# EasyEDA schematic 1-Schematic_客制化980.json

## Sheets
1 布局: TITLE: Sheet_1; REV: 1.0; Date: 2020-04-07; Sheet: 1/1; Drawn By: ye992; Company: Your Company
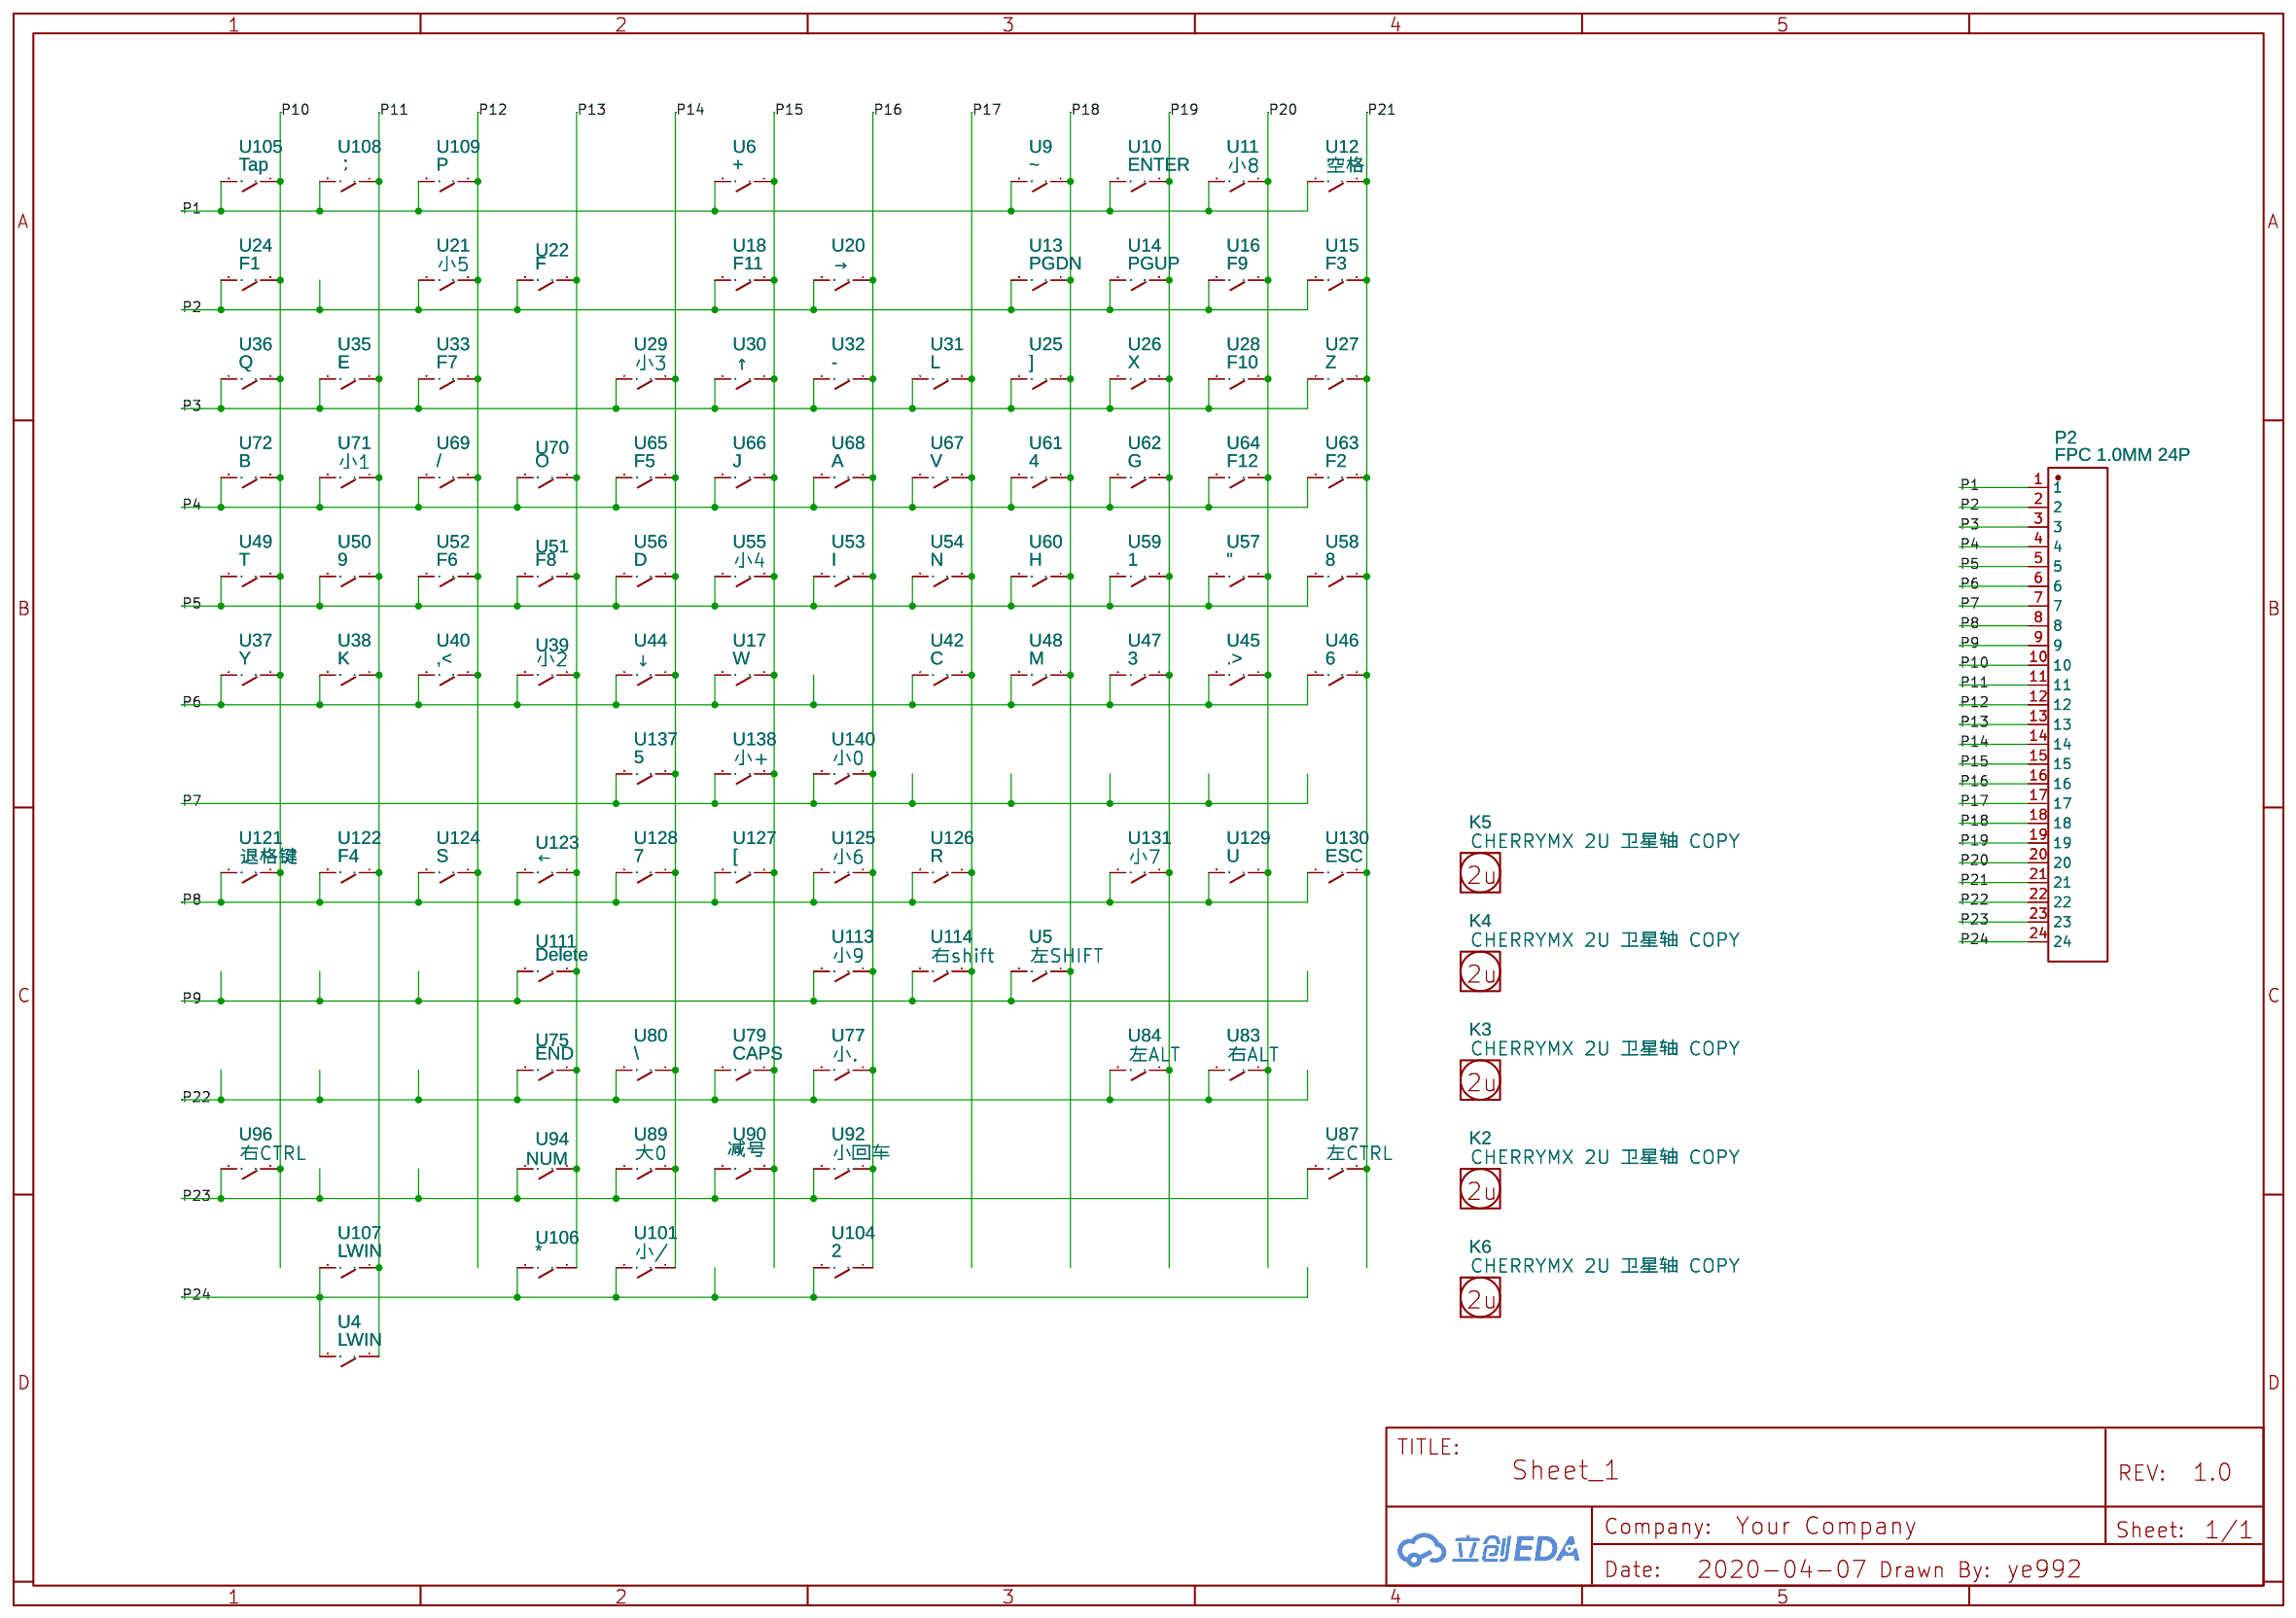
[diagram p0: 布局]
2 Sheet_1: Date: 2020-04-06
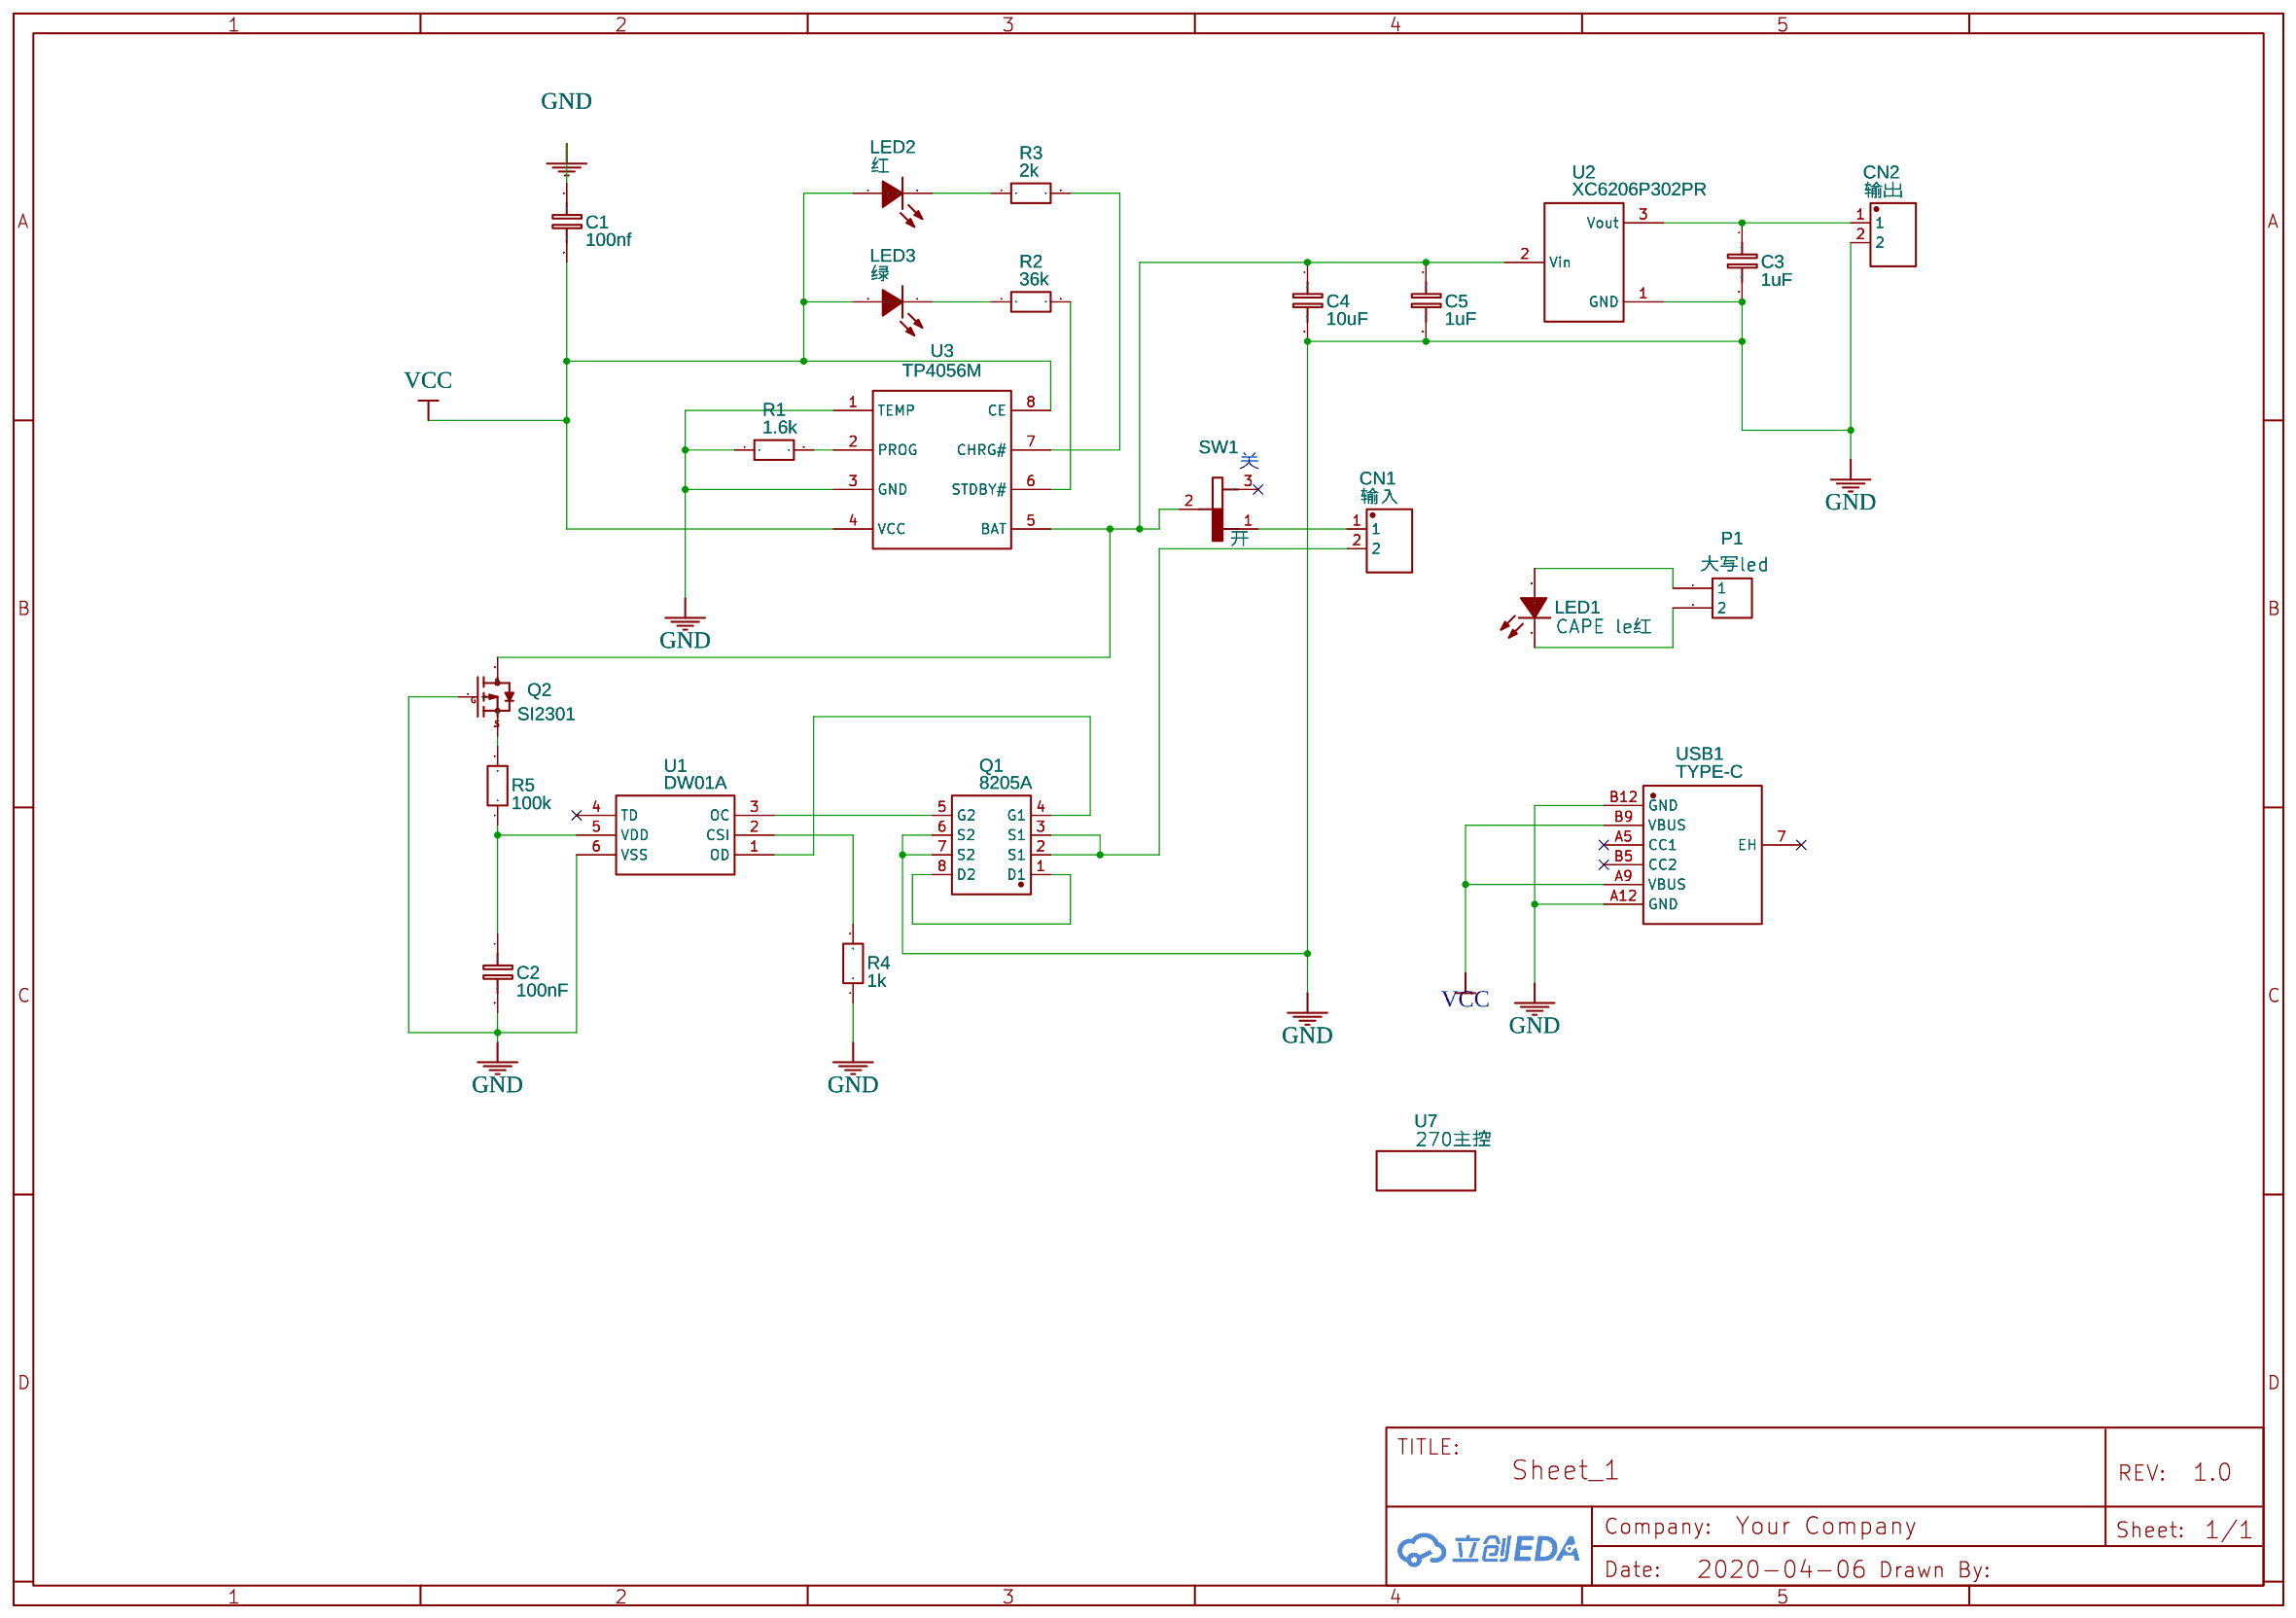
[diagram p1: Sheet_1]

## Parts
sheet Sheet_1
C1  100nf  [1206]
C2  100nF  [1206]
C3  1uF  [1206]
C4  10uF  [1206]
C5  1uF  [1206]
CN1  输入  [DIP-1X2P-2.54MM(5.08X5.08)]
CN2  输出  [DIP-1X2P-2.54MM(5.08X5.08)]
LED1  CAPE le红  [LED1206-R-RD]
LED2  红  [LED1206-R-RD]
LED3  绿  [LED1206-RD]
P1  大写led  [HDR-TH_2P-P2.54-V-M]
Q1  8205A  [TSSOP-8_L4.4-W3.0-P0.65-LS6.4-BL]
Q2  SI2301  [SOT-23-3_L2.9-W1.3-P1.90-LS2.4-BR]
R1  1.6k  [1206]
R2  36k  [1206]
R3  2k  [1206]
R4  1k  [1206]
R5  100k  [1206]
SW1  开  [滑动开关]
U1  DW01A  [SOT-23-6_L2.9-W1.6-P0.95-LS2.8-BL]
U2  XC6206P302PR  [SOT-89_L4.5-W2.5-P1.50-LS4.2-BR]
U3  TP4056M  [MSOP-8_L3.0-W3.0-P0.65-LS5.0-BL-EP]
U7  270主控  [270主控]
USB1  TYPE-C  [TYPE-C-SMD_TYPE-C-6P]
sheet 布局
K2  CHERRYMX 2U 卫星轴 COPY  [CHERRY_MX_2U_卫星轴]
K3  CHERRYMX 2U 卫星轴 COPY  [CHERRY_MX_2U_卫星轴]
K4  CHERRYMX 2U 卫星轴 COPY  [CHERRY_MX_2U_卫星轴]
K5  CHERRYMX 2U 卫星轴 COPY  [CHERRY_MX_2U_卫星轴]
K6  CHERRYMX 2U 卫星轴 COPY  [CHERRY_MX_2U_卫星轴]
P2  FPC 1.0MM 24P  [FPC 1.0MM 24P NO CONNECTOR]
U4  LWIN  [MICAH凯华KAILH热插拔底座]
U5  左SHIFT  [KAILH 2.25U-双用]
U6  +  [MICAH凯华KAILH热插拔底座]
U9  -  [MICAH凯华KAILH热插拔底座]
U10  ENTER  [KAILH 2.25U-双用]
U11  小8  [MICAH凯华KAILH热插拔底座]
U12  空格  [KAILH 6.25U 双用]
U13  PGDN  [MICAH凯华KAILH热插拔底座]
U14  PGUP  [MICAH凯华KAILH热插拔底座]
U15  F3  [MICAH凯华KAILH热插拔底座]
U16  F9  [MICAH凯华KAILH热插拔底座]
U17  W  [MICAH凯华KAILH热插拔底座]
U18  F11  [MICAH凯华KAILH热插拔底座]
U20  →  [MICAH凯华KAILH热插拔底座]
U21  小5  [MICAH凯华KAILH热插拔底座]
U22  F  [MICAH凯华KAILH热插拔底座]
U24  F1  [MICAH凯华KAILH热插拔底座]
U25  ]  [MICAH凯华KAILH热插拔底座]
U26  X  [MICAH凯华KAILH热插拔底座]
U27  Z  [MICAH凯华KAILH热插拔底座]
U28  F10  [MICAH凯华KAILH热插拔底座]
U29  小3  [MICAH凯华KAILH热插拔底座]
U30  ↑  [MICAH凯华KAILH热插拔底座]
U31  L  [MICAH凯华KAILH热插拔底座]
U32  -  [MICAH凯华KAILH热插拔底座]
U33  F7  [MICAH凯华KAILH热插拔底座]
U35  E  [MICAH凯华KAILH热插拔底座]
U36  Q  [MICAH凯华KAILH热插拔底座]
U37  Y  [MICAH凯华KAILH热插拔底座]
U38  K  [MICAH凯华KAILH热插拔底座]
U39  小2  [MICAH凯华KAILH热插拔底座]
U40  ,<  [MICAH凯华KAILH热插拔底座]
U42  C  [MICAH凯华KAILH热插拔底座]
U44  ↓  [MICAH凯华KAILH热插拔底座]
U45  .>  [MICAH凯华KAILH热插拔底座]
U46  6  [MICAH凯华KAILH热插拔底座]
U47  3  [MICAH凯华KAILH热插拔底座]
U48  M  [MICAH凯华KAILH热插拔底座]
U49  T  [MICAH凯华KAILH热插拔底座]
U50  9  [MICAH凯华KAILH热插拔底座]
U51  F8  [MICAH凯华KAILH热插拔底座]
U52  F6  [MICAH凯华KAILH热插拔底座]
U53  I  [MICAH凯华KAILH热插拔底座]
U54  N  [MICAH凯华KAILH热插拔底座]
U55  小4  [MICAH凯华KAILH热插拔底座]
U56  D  [MICAH凯华KAILH热插拔底座]
U57  "  [MICAH凯华KAILH热插拔底座]
U58  8  [MICAH凯华KAILH热插拔底座]
U59  1  [MICAH凯华KAILH热插拔底座]
U60  H  [MICAH凯华KAILH热插拔底座]
U61  4  [MICAH凯华KAILH热插拔底座]
U62  G  [MICAH凯华KAILH热插拔底座]
U63  F2  [MICAH凯华KAILH热插拔底座]
U64  F12  [MICAH凯华KAILH热插拔底座]
U65  F5  [MICAH凯华KAILH热插拔底座]
U66  J  [MICAH凯华KAILH热插拔底座]
U67  V  [MICAH凯华KAILH热插拔底座]
U68  A  [MICAH凯华KAILH热插拔底座]
U69  /  [MICAH凯华KAILH热插拔底座]
U70  O  [MICAH凯华KAILH热插拔底座]
U71  小1  [MICAH凯华KAILH热插拔底座]
U72  B  [MICAH凯华KAILH热插拔底座]
U75  END  [MICAH凯华KAILH热插拔底座]
U77  小.  [MICAH凯华KAILH热插拔底座]
U79  CAPS  [MICAH MX_1.75U_KAILH_SOCKET_LL4148]
U80  \  [KAILH 1.5U-双用]
U83  右ALT  [MICAH凯华KAILH热插拔底座]
U84  左ALT  [C-MX-HH-1.25U-K]
U87  左CTRL  [C-MX-HH-1.25U-K]
U89  大0  [MICAH凯华KAILH热插拔底座]
U90  减号  [MICAH凯华KAILH热插拔底座]
U92  小回车  [MICAH MX_2U_KAILH_SOCKET_LL4148]
U94  NUM  [MICAH凯华KAILH热插拔底座]
U96  右CTRL  [MICAH凯华KAILH热插拔底座]
U101  小/  [MICAH凯华KAILH热插拔底座]
U104  2  [MICAH凯华KAILH热插拔底座]
U105  Tap  [KAILH 1.5U-双用]
U106  *  [MICAH凯华KAILH热插拔底座]
U107  LWIN  [C-MX-HH-1.25U-K]
U108  ；  [MICAH凯华KAILH热插拔底座]
U109  P  [MICAH凯华KAILH热插拔底座]
U111  Delete  [MICAH凯华KAILH热插拔底座]
U113  小9  [MICAH凯华KAILH热插拔底座]
U114  右shift  [MICAH MX_1.75U_KAILH_SOCKET_LL4148]
U121  退格键  [MICAH MX_2U_KAILH_SOCKET_LL4148]
U122  F4  [MICAH凯华KAILH热插拔底座]
U123  ←  [MICAH凯华KAILH热插拔底座]
U124  S  [MICAH凯华KAILH热插拔底座]
U125  小6  [MICAH凯华KAILH热插拔底座]
U126  R  [MICAH凯华KAILH热插拔底座]
U127  [  [MICAH凯华KAILH热插拔底座]
U128  7  [MICAH凯华KAILH热插拔底座]
U129  U  [MICAH凯华KAILH热插拔底座]
U130  ESC  [MICAH凯华KAILH热插拔底座]
U131  小7  [MICAH凯华KAILH热插拔底座]
U137  5  [MICAH凯华KAILH热插拔底座]
U138  小+  [MICAH MX_2U_KAILH_SOCKET_LL4148]
U140  小0  [MICAH凯华KAILH热插拔底座]

## Library data of the parts
C1-C5 = Cap_1206_EU
CN1 CN2 = 2510S-2P: Supplier: LCSC; Manufacturer: Ckmtw; Contributor: LCSC; Supplier Part: C132504
LED1 LED2 = FC-3215HRK-620D: Supplier: LCSC; Manufacturer: NATIONSTAR; image: //image.lceda.cn/szlcsc/C84270.jpg; Supplier Part: C84270; LCSC Assembly: Yes; SMT Type: Extend
LED3 = FC-3215UGK-520D: Supplier: LCSC; Manufacturer: NATIONSTAR; Supplier Part: C99881; LCSC Assembly: Yes; SMT Type: Extend
P1 = 2.54mm 1*2P: Supplier: LCSC; Manufacturer: ReliaPro; image: http://image.lceda.cn/szlcsc/C36717.jpg; Supplier Part: C36717
Q1 = 8205A: Supplier: LCSC; Manufacturer: Hottech; Contributor: LCSC; Supplier Part: C181100; LCSC Assembly: Yes; SMT Type: Extend
Q2 = SI2301: Supplier: LCSC; Manufacturer: Hottech; Contributor: LCSC; Supplier Part: C181086; LCSC Assembly: Yes; SMT Type: Extend
R1-R5 = Res_1206(1/4W)_EU
SW1 = CSJ-1206-PAP31-14R: Supplier: LCSC; Supplier Part: C248278; Manufacturer: DEFOND; Contributor: LCSC
U1 = DW01A: Supplier: LCSC; Manufacturer: FM; Supplier Part: C85680; LCSC Assembly: Yes; SMT Type: Extend
U2 = XC6206P302PR: Supplier: LCSC; Manufacturer: TOREX; image: //image.lceda.cn/szlcsc/C34506.jpg; Supplier Part: C34506; LCSC Assembly: Yes; SMT Type: Extend
U3 = TP4056M: Supplier: LCSC; Manufacturer: TOPPOWER; Supplier Part: C21417; LCSC Assembly: Yes; SMT Type: Extend
U7 = 270主控: Contributor: ye992
USB1 = TYPE-C 6P: Supplier: LCSC; Supplier Part: C456012; Manufacturer: SHOU HAN; Contributor: LCSC; Package Display: No
K2-K6 = CHERRYMX 2U 卫星轴 COPY: Manufacturer Part: Cherry MX; Contributor: qxs.c
P2 = fpc24p （FPC 1.0MM 24P NO CONNECTOR）: Supplier: LCSC; Manufacturer: BOOMELE; Manufacturer Part: FPC 1.0mmpitch 24P Pull type Under the next; image: //image.lceda.cn/szlcsc/C48186.jpg; Supplier Part: C48186; Contributor: hh909654626
U4-U6 U9-U18 U20-U22 U24-U33 U35-U40 U42 U44-U72 U75 U77 U79 U80 U83 U84 U89 U90 U92 U94 U96 U101 U104-U109 U111 U113 U114 U121-U131 U137 U138 U140 = CHERRY: Contributor: nicholasyoo
U87 = CHERRY: Contributor: nicholasyoo; Package Display: No

## Nets
GND: C1.1 C2.2 C3.2 C4.2 C5.2 CN2.2 Q1.6(S2) Q1.7(S2) Q2.1(G) R1.1 R4.1 U1.6(VSS) U2.1(GND) U3.1(TEMP) U3.3(GND) USB1.A12(GND) USB1.B12(GND)
VCC: C1.2 LED2.1(A) LED3.2(+) U3.4(VCC) U3.8(CE) USB1.A9(VBUS) USB1.B9(VBUS)
P1: P2.1 U6.2 U9.2 U10.2 U11.2 U12.2 U105.2 U108.2 U109.2
P2: P2.2 U13.2 U14.2 U15.2 U16.2 U18.2 U20.2 U21.2 U22.2 U24.2
P3: P2.3 U25.2 U26.2 U27.2 U28.2 U29.2 U30.2 U31.2 U32.2 U33.2 U35.2 U36.2
P4: P2.4 U61.2 U62.2 U63.2 U64.2 U65.2 U66.2 U67.2 U68.2 U69.2 U70.2 U71.2 U72.2
P5: P2.5 U49.2 U50.2 U51.2 U52.2 U53.2 U54.2 U55.2 U56.2 U57.2 U58.2 U59.2 U60.2
P6: P2.6 U17.2 U37.2 U38.2 U39.2 U40.2 U42.2 U44.2 U45.2 U46.2 U47.2 U48.2
P7: P2.7 U137.2 U138.2 U140.2
P8: P2.8 U121.2 U122.2 U123.2 U124.2 U125.2 U126.2 U127.2 U128.2 U129.2 U130.2 U131.2
P9: P2.9 U5.2 U111.2 U113.2 U114.2
P10: P2.10 U24.1 U36.1 U37.1 U49.1 U72.1 U96.1 U105.1 U121.1
P11: P2.11 U4.1 U35.1 U38.1 U50.1 U71.1 U107.1 U108.1 U122.1
P12: P2.12 U21.1 U33.1 U40.1 U52.1 U69.1 U109.1 U124.1
P13: P2.13 U22.1 U39.1 U51.1 U70.1 U75.1 U94.1 U106.1 U111.1 U123.1
P14: P2.14 U29.1 U44.1 U56.1 U65.1 U80.1 U89.1 U101.1 U128.1 U137.1
P15: P2.15 U6.1 U17.1 U18.1 U30.1 U55.1 U66.1 U79.1 U90.1 U127.1 U138.1
P16: P2.16 U20.1 U32.1 U53.1 U68.1 U77.1 U92.1 U104.1 U113.1 U125.1 U140.1
P17: P2.17 U31.1 U42.1 U54.1 U67.1 U114.1 U126.1
P18: P2.18 U5.1 U9.1 U13.1 U25.1 U48.1 U60.1 U61.1
P19: P2.19 U10.1 U14.1 U26.1 U47.1 U59.1 U62.1 U84.1 U131.1
P20: P2.20 U11.1 U16.1 U28.1 U45.1 U57.1 U64.1 U83.1 U129.1
P21: P2.21 U12.1 U15.1 U27.1 U46.1 U58.1 U63.1 U87.1 U130.1
P22: P2.22 U75.2 U77.2 U79.2 U80.2 U83.2 U84.2
P23: P2.23 U87.2 U89.2 U90.2 U92.2 U94.2 U96.2
P24: P2.24 U4.2 U101.2 U104.2 U106.2 U107.2
Net-(C2-1): C2.1 R5.1 U1.5(VDD)
Net-(C3-1): C3.1 CN2.1 U2.3(Vout)
Net-(C4-1): C4.1 C5.1 Q2.3(D) SW1.2 U2.2(Vin) U3.5(BAT)
Net-(CN1-1): CN1.1 SW1.1
Net-(CN1-2): CN1.2 Q1.2(S1) Q1.3(S1)
Net-(LED1-1): LED1.1(A) P1.1
Net-(LED1-2): LED1.2(K) P1.2
Net-(LED2-2): LED2.2(K) R3.1
Net-(LED3-1): LED3.1(-) R2.1
Net-(Q1-1): Q1.1(D1) Q1.8(D2)
Net-(Q1-4): Q1.4(G1) U1.1(OD)
Net-(Q1-5): Q1.5(G2) U1.3(OC)
Net-(Q2-2): Q2.2(S) R5.2
Net-(R1-2): R1.2 U3.2(PROG)
Net-(R2-2): R2.2 U3.6(STDBY#)
Net-(R3-2): R3.2 U3.7(CHRG#)
Net-(R4-2): R4.2 U1.2(CSI)

Not connected (* = marked no-connect by the designer): SW1 3*; U1 4(TD)*; USB1 7(EH)* A5(CC1)* B5(CC2)*

## Notes on the sheets
sheet 2
- 关
